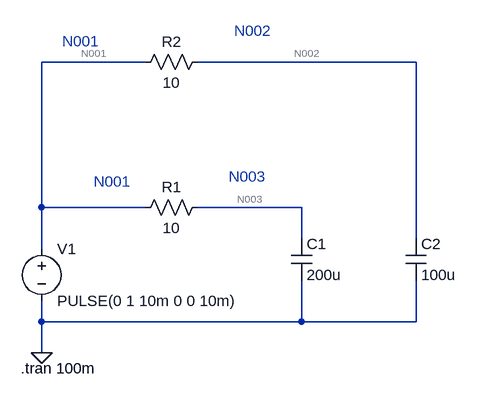
[diagram p0: schematic Yoneda-p52__Pulse+R+C=200u__v2-2Circuits.asc]
Yoneda-p52__Pulse+R+C=200u__v2-2Circuits.asc, the LTspice schematic file:
Version 4
SHEET 1 1064 680
WIRE 576 -672 416 -672
WIRE 992 -672 656 -672
WIRE 416 -448 416 -672
WIRE 576 -448 416 -448
WIRE 816 -448 656 -448
WIRE 816 -400 816 -448
WIRE 992 -400 992 -672
WIRE 416 -384 416 -448
WIRE 416 -272 416 -304
WIRE 816 -272 816 -336
WIRE 816 -272 416 -272
WIRE 992 -272 992 -336
WIRE 992 -272 816 -272
WIRE 416 -224 416 -272
FLAG 416 -224 0
SYMBOL voltage 416 -400 R0
WINDOW 123 0 0 Left 2
WINDOW 39 0 0 Left 2
SYMATTR InstName V1
SYMATTR Value PULSE(0 1 10m 0 0 10m)
SYMBOL res 560 -432 R270
WINDOW 0 32 56 VTop 2
WINDOW 3 0 56 VBottom 2
SYMATTR InstName R1
SYMATTR Value 10
SYMBOL cap 800 -400 R0
SYMATTR InstName C1
SYMATTR Value 200u
SYMBOL res 560 -656 R270
WINDOW 0 32 56 VTop 2
WINDOW 3 0 56 VBottom 2
SYMATTR InstName R2
SYMATTR Value 10
SYMBOL cap 976 -400 R0
SYMATTR InstName C2
SYMATTR Value 100u
TEXT 384 -200 Left 2 !.tran 100m
TEXT 448 -704 Left 2 ;N001
TEXT 712 -720 Left 2 ;N002
TEXT 496 -488 Left 2 ;N001
TEXT 704 -496 Left 2 ;N003

The netlist it stands for:
* Yoneda-p52__Pulse+R+C=200u__v2-2Circuits.asc
V1 N001 0 PULSE(0 1 10m 0 0 10m)
R1 N001 N003 10
C1 N003 0 200u
R2 N001 N002 10
C2 N002 0 100u
.tran 100m
* N001
* N002
* N001
* N003
.backanno
.end

* Results of the author's LTspice run, read from the files saved beside the schematic
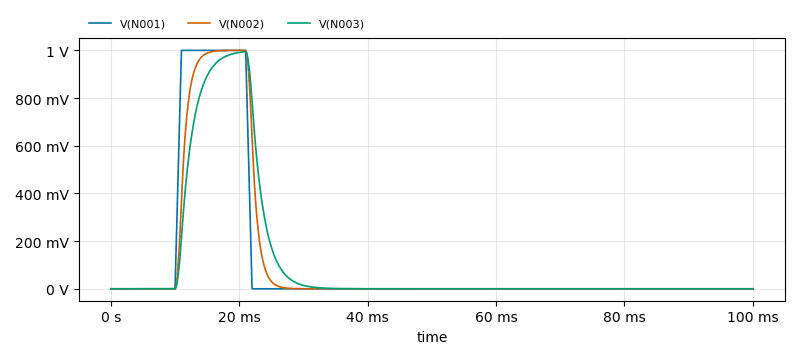
[diagram p1: Transient Analysis of Yoneda-p52__Pulse+R+C=200u__v2-2Circuits.asc, plotted from the saved traces]
* Transient Analysis, 1 run:
*   V(N001): min 0 V, max 1 V, average 110 mV, rms 326.7 mV, last 0 V
*   V(N002): min 0 V, max 1 V, average 110 mV, rms 315.1 mV, last 0 V
*   V(N003): min 0 V, max 994.7 mV, average 110 mV, rms 299.5 mV, last 0 V